# EAGLE schematic fabkit02 (EAGLE 5.11)
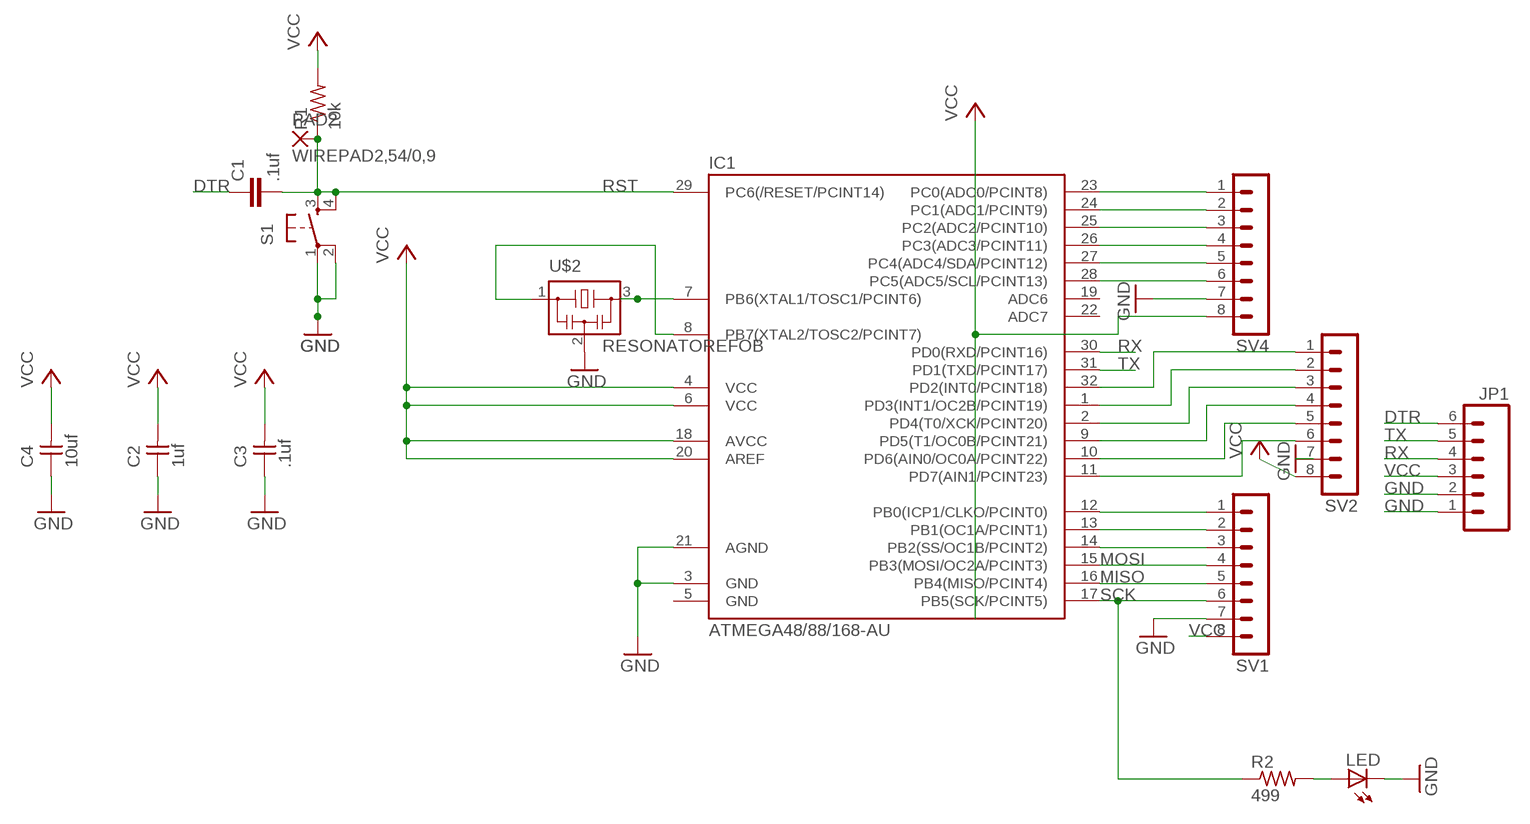
[diagram p0: schematic, sheet 1]

## Parts
C1  .1uf  C-EUC1206  [C1206]
C2  1uf  UNPOLARIZED_CAPACITOR1206  [1206]
C3  .1uf  UNPOLARIZED_CAPACITOR1206  [1206]
C4  10uf  UNPOLARIZED_CAPACITOR1206  [1206]
IC1  ATMEGA48/88/168-AU  [TQFP32-08]
JP1  M06SMD  [1X06-SMD]
LED  LED1206  [1206]
PAD2  WIREPAD2,54/0,9  [2,54/0,9]
R1  10k  RESISTOR1206  [1206]
R2  499  RESISTOR1206  [1206]
S1  6MM_SWITCH6MM_SWITCH  [6MM_SWITCH]
SV1  MA08-1  [MA08-1]
SV2  MA08-1  [MA08-1]
SV4  MA08-1  [MA08-1]
U$2  RESONATOREFOB  [EFOBM]

## Nets
DTR: C1.1 JP1.6
GND: C2.1 C3.1 C4.1 IC1.3(GND) IC1.21(AGND) JP1.1 JP1.2 LED.2(C) S1.1(P) S1.2(P1) SV1.7 SV2.7 SV4.7 U$2.2
MISO: IC1.16(PB4(MISO/PCINT4)) SV1.5
MOSI: IC1.15(PB3(MOSI/OC2A/PCINT3)) SV1.4
N$1: IC1.8(PB7(XTAL2/TOSC2/PCINT7)) U$2.1
N$2: IC1.12(PB0(ICP1/CLKO/PCINT0)) SV1.1
N$3: IC1.23(PC0(ADC0/PCINT8)) SV4.1
N$4: IC1.24(PC1(ADC1/PCINT9)) SV4.2
N$5: IC1.25(PC2(ADC2/PCINT10)) SV4.3
N$6: IC1.26(PC3(ADC3/PCINT11)) SV4.4
N$7: IC1.27(PC4(ADC4/SDA/PCINT12)) SV4.5
N$8: IC1.28(PC5(ADC5/SCL/PCINT13)) SV4.6
N$9: IC1.7(PB6(XTAL1/TOSC1/PCINT6)) U$2.3
N$10: IC1.32(PD2(INT0/PCINT18)) SV2.1
N$11: IC1.1(PD3(INT1/OC2B/PCINT19)) SV2.2
N$12: IC1.2(PD4(T0/XCK/PCINT20)) SV2.3
N$13: IC1.9(PD5(T1/OC0B/PCINT21)) SV2.4
N$14: IC1.10(PD6(AIN0/OC0A/PCINT22)) SV2.5
N$15: IC1.11(PD7(AIN1/PCINT23)) SV2.6
N$17: IC1.13(PB1(OC1A/PCINT1)) SV1.2
N$18: IC1.14(PB2(SS/OC1B/PCINT2)) SV1.3
N$23: LED.1(A) R2.2
RST: C1.2 IC1.29(PC6(/RESET/PCINT14)) PAD2.1(P) R1.1 S1.3(S) S1.4(S1)
RX: IC1.30(PD0(RXD/PCINT16)) JP1.4
SCK: IC1.17(PB5(SCK/PCINT5)) R2.1 SV1.6
TX: IC1.31(PD1(TXD/PCINT17)) JP1.5
VCC: C2.2 C3.2 C4.2 IC1.4(VCC) IC1.6(VCC) IC1.18(AVCC) IC1.20(AREF) JP1.3 R1.2 SV1.8 SV2.8 SV4.8
Unconnected: IC1.19(ADC6) IC1.22(ADC7)

## Power pins joined to a net without a drawn wire
GND: IC1.5(GND)

## Library data of the parts
C1 = rcl:C-EU: CAPACITOR, European symbol
C2-C4 = ng:UNPOLARIZED_CAPACITOR: unpolarized_capacitor
IC1 = atmega8:ATMEGA48/88/168
JP1 = SparkFun:M06: Header 6 Standard 6-pin 0.1" header. Use with straight break away headers (SKU : PRT-00116), right angle break away headers (PRT-00553), swiss pins (PRT-00743), machine pins (PRT-00117), and female headers (PRT-00115). Molex polarized connector foot print use with SKU : PRT-08094 with associated crimp pins and housings. NOTES ON THE VARIANTS LOCK and LOCK_LONGPADS... This footprint was designed to help hold the alignment of a through-hole component (i.e. 6-pin header) while soldering it into place. You may notice that each hole has been shifted either up or down by 0.005 of an inch from it's more standard position (which is a perfectly straight line). This slight alteration caused the pins (the squares in the middle) to touch the edges of the holes. Because they are alternating, it causes a "brace" to hold the component in place. 0.005 has proven to be the perfect amount of "off-center" position when using our standard breakaway headers. Although looks a little odd when you look at the bare footprint, once you have a header in there, the alteration is very hard to notice. Also, if you push a header all the way into place, it is covered up entirely on the bottom side. This idea of altering the position of holes to aid alignment will be further integrated into the Sparkfun Library for other footprints. It can help hold any component with 3 or more connection pins.
LED = ng:LED
PAD2 = wirepad:WIREPAD: Wire PAD connect wire on PCB
R1 R2 = ng:RESISTOR
S1 = ng:6MM_SWITCH: OMRON SWITCH
SV1 SV2 SV4 = con-lstb:MA08-1: PIN HEADER
U$2 = fab:RESONATOR